# Altium project Robofest.PrjPcb
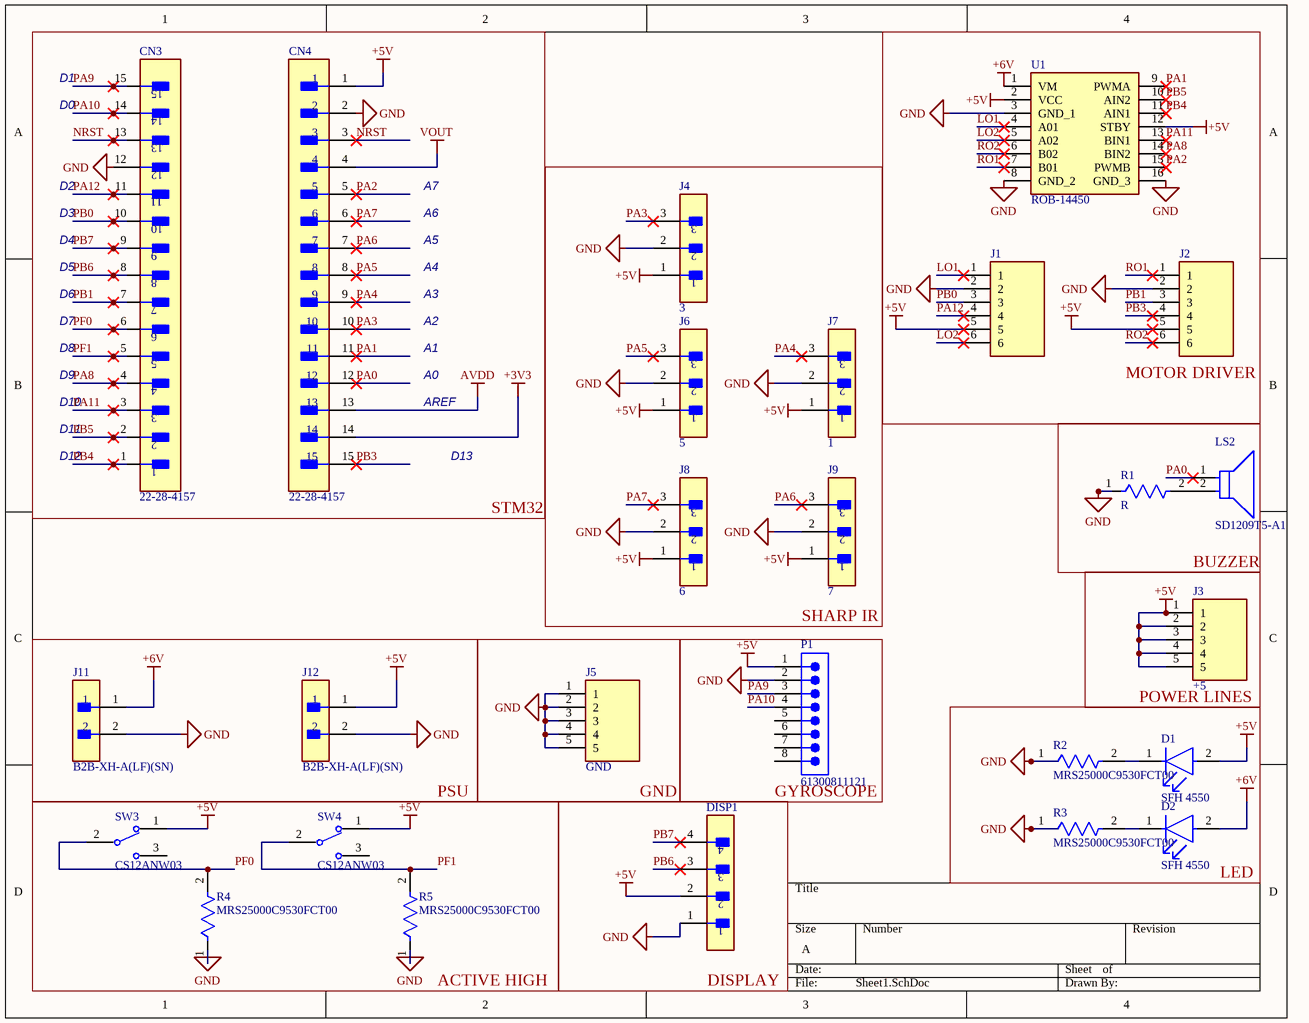
[diagram p0: Sheet1.SchDoc]
1 sheet, 26 parts. Net scope: global (net labels, ports and power ports of the same name join across sheets).
Board file: Sheet1.PcbDoc

## Sheet Sheet1.SchDoc
size A; SheetNumber: 1; SheetTotal: 1

### Parts
CN3  22-28-4157  [FP-22-28-4157-MFG]
CN4  22-28-4157  [FP-22-28-4157-MFG]
D1  SFH 4550  [FP-SFH_4550-MFG]
D2  SFH 4550  [FP-SFH_4550-MFG]
DISP1  B4B-XH-A(LF)(SN)  [FP-B4B-XH-A_LF_SN-MFG]  (value not drawn)
J1  B6B-XH-A_LF__SN_  [SHDR6W64P0X250_1X6_1740X575X700P]  (value not drawn)
J2  B6B-XH-A_LF__SN_  [SHDR6W64P0X250_1X6_1740X575X700P]  (value not drawn)
J3  +5  [SHDR5W64P0X250_1X5_1490X575X700P]
J4  3  [FP-B3B-XH-A_LF_SN-MFG]
J5  GND  [SHDR5W64P0X250_1X5_1490X575X700P]
J6  5  [FP-B3B-XH-A_LF_SN-MFG]
J7  1  [FP-B3B-XH-A_LF_SN-MFG]
J8  6  [FP-B3B-XH-A_LF_SN-MFG]
J9  7  [FP-B3B-XH-A_LF_SN-MFG]
J11  B2B-XH-A(LF)(SN)  [FP-B2B-XH-A_LF_SN-MFG]
J12  B2B-XH-A(LF)(SN)  [FP-B2B-XH-A_LF_SN-MFG]
LS2  SD1209T5-A1  [FP-SD1209-MFG]
P1  61300811121  [61300811121]
R1  R  [FP-MRS25-MFG]
R2  MRS25000C9530FCT00  [FP-MRS25-MFG]
R3  MRS25000C9530FCT00  [FP-MRS25-MFG]
R4  MRS25000C9530FCT00  [FP-MRS25-MFG]
R5  MRS25000C9530FCT00  [FP-MRS25-MFG]
SW3  CS12ANW03  [FP-CS12ANW03-MFG]
SW4  CS12ANW03  [FP-CS12ANW03-MFG]
U1  ROB-14450  [ROB14450]

### Blocks framed on the sheet
STM32: CN3 CN4
MOTOR DRIVER: J1 J2 U1
SHARP IR: J4 J6-J9
BUZZER: LS2 R1
PSU: J11 J12
GND: J5
ACTIVE HIGH: R4 R5 SW3 SW4

### Nets
+3V3: CN4.14
+5V: CN4.1 D1.2(A) DISP1.2 J1.5 J2.5 J3.1 J3.2 J3.3 J3.4 J3.5 J4.1 J6.1 J7.1 J8.1 J9.1 J12.1 P1.1 SW3.1 SW4.1 U1.2(VCC) U1.12(STBY)
+6V: D2.2(A) J11.1 U1.1(VM)
AVDD: CN4.13
GND: CN3.12 CN4.2 DISP1.1 J1.2 J2.2 J4.2 J5.1 J5.2 J5.3 J5.4 J5.5 J6.2 J7.2 J8.2 J9.2 J11.2 J12.2 P1.2 R1.1 R2.1 R3.1 R4.1 R5.1 U1.3(GND_1) U1.8(GND_2) U1.16(GND_3)
VOUT: CN4.4
LO1: J1.1 U1.4(A01)
LO2: J1.6 U1.5(A02)
NRST: CN3.13 CN4.3
PA0: CN4.12 LS2.1(C)
PA1: CN4.11 U1.9(PWMA)
PA2: CN4.5 U1.15(PWMB)
PA3: CN4.10 J4.3
PA4: CN4.9 J7.3
PA5: CN4.8 J6.3
PA6: CN4.7 J9.3
PA7: CN4.6 J8.3
PA8: CN3.4 U1.14(BIN2)
PA9: CN3.15 P1.3
PA10: CN3.14 P1.4
PA11: CN3.3 U1.13(BIN1)
PA12: CN3.11 J1.4
PB0: CN3.10 J1.3
PB1: CN3.7 J2.3
PB3: CN4.15 J2.4
PB4: CN3.1 U1.11(AIN1)
PB5: CN3.2 U1.10(AIN2)
PB6: CN3.8 DISP1.3
PB7: CN3.9 DISP1.4
PF0: CN3.6 R4.2 SW3.2(2(COM))
PF1: CN3.5 R5.2 SW4.2(2(COM))
RO1: J2.1 U1.7(B01)
RO2: J2.6 U1.6(B02)
NetD1_1: D1.1(C) R2.2
NetD2_1: D2.1(C) R3.2
NetLS2_2: LS2.2(A) R1.2

Not connected (* = marked no-connect by the designer): P1 5 6 7 8; SW3 3; SW4 3

### Notes on the sheet
- D1
- D0
- D2
- D3
- A6
- A7
- D4
- D5
- D6
- A3
- A4
- A5
- D7
- D8
- A1
- A2
- D9
- D10
- D11
- A0
- AREF
- D12
- D13
- (near J3) POWER LINES
- (near P1) GYROSCOPE
- (near D2) LED
- (near DISP1) DISPLAY

### Library data of the parts
CN3 CN4 = CMP-04776-000945-1: KK 100 HDR ASSY BKWY 15 CKT 30 S; Number of Circuits: 15; Max Voltage Rating (DC): 250.25kV; Connector Type: Male Pin; Current Rating: 4A; Glow Wire Compliant: Non-compliant; Contact Resistance: 20mR; Pitch: 2.54mm; Gender: Male; Voltage Rating: 250V; Contact Mating Length: 0.32inch; Packaging: Bulk; Min Operating Temperature: 0°C; Contact Material: Brass; Max Operating Temperature: 75°C; Number of Positions: 15; Housing Material: Thermoplastic; Termination: Solder; Number of Contacts: 15; Lead Free: Lead Free; Contact Plating: Gold; Color: Black; Housing Color: Black; Contact Type: Male Pin; Series: KK® 42375; Package Quantity: 1; Number of Rows: 1; Orientation: Straight; Mount: Through Hole
D1 D2 = CMP-62016-000011-1: EMITTER IR 860NM 100MA RADIAL; Manufacturer: Osram Opto; Forward Voltage: 1.5V; Reverse Voltage: 5V; Viewing Angle: 6°; Led Orientation: Straight; Colour: Infrared; Mouser Description: Infrared Emitters - High Power Infrared 850 nm HALF ANGLE +/-3DEG; RoHS: TRUE; Manufacturer Part Number: SFH 4550; Forward Current: 100mA; Octopart: https://octopart.com/sfh+4550-osram+opto-55410894; ComponentLink2Description: Datasheet; Lead Free: Yes; Temperature: -40°C to +100°C; ComponentLink2URL: https://dammedia.osram.info/media/resource/hires/osram-dam-5580407/SFH%204550_EN.pdf; Device Class L2: LEDs; Temperature Range Low: -40°C; Digikey Description: EMITTER IR 860NM 100MA RADIAL; Temperature Range High: +100°C; Device Class L3: unset; Peak Emmision Wavelength: 860nm; Category: Diode; Package: SFH 4550; Device Class L1: Optoelectronics; Automotive: No
DISP1 = CMP-17439-000250-1: CONN HEADER VERT 4POS 2.5MM; Number of Contacts: 4; Contact Resistance: 20mR; Voltage Rating: 250V; Max Current Rating: 3A; Gender: Male; Wire/Cable Gauge: 22AWG; Mated Stacking Heights: 9.8mm; Insulation Resistance: 1GR; Orientation: Straight; Contact Type: Male Pin; Contact Finish - Mating: TIN; Series: XH; Max Voltage Rating (AC): 250V; Lead Pitch: 2.5mm; Contact Shape: Square; Insulation Color: Natural; Termination: Solder; Lead Free: Lead Free; Voltage Rating (AC): 250V; Number of Rows: 1; Flammability Rating: UL94 V-0; Number of Positions: 4; Max Operating Temperature: 85°C; Package Quantity: 500; Mount: Through Hole; REACH SVHC: No SVHC; Connector Type: Header; Insulation Material: Nylon; Fastening Type: Detent; Min Operating Temperature: -25°C; Housing Color: White; Packaging: Bulk; Contact Plating: Tin; Contact Material: Brass; Max Voltage Rating (DC): 250V; Housing Material: Polyamide; Color: Natural; Material: Polyamide; Pitch: 2.5mm; Depth: 5.75mm; Current Rating: 3A; Length: 12.4mm
J1 J2 = B6B-XH-A_LF__SN_: Connector; Manufacturer_Name: JST (JAPAN SOLDERLESS TERMINALS); Manufacturer_Part_Number: B6B-XH-A(LF)(SN); Datasheet Link: https://datasheet.lcsc.com/szlcsc/JST-Sales-America-B6B-XH-A-LF-SN_C144397.pdf; Height: 7mm; Arrow Part Number: B6B-XH-A(LF)(SN); Arrow Price/Stock: https://www.arrow.com/en/products/b6b-xh-a-lf-sn/jst-manufacturing?utm_currency=USD&region=europe
J3 J5 = B5B-XH-A_LF__SN_: Connector; Manufacturer_Name: JST (JAPAN SOLDERLESS TERMINALS); Manufacturer_Part_Number: B5B-XH-A(LF)(SN); Datasheet Link: http://www.jst-mfg.com/product/pdf/eng/eXH.pdf; Height: 7mm; Arrow Part Number: B5B-XH-A(LF)(SN); Arrow Price/Stock: https://www.arrow.com/en/products/b5b-xh-a-lf-sn/jst-manufacturing
J4 = CMP-17439-000014-3: CONN HEADER VERT 3POS 2.5MM; Max Voltage Rating (DC): 250V; Current Rating: 3A; Gender: Male; Wire/Cable Gauge: 22AWG; Contact Resistance: 20mR; Insulation Resistance: 1GR; Insulation Material: Nylon; Number of Positions: 3; Contact Plating: Tin; Depth: 5.75mm; Contact Type: Male Pin; Max Operating Temperature: 85°C; Insulation Color: Natural; Voltage Rating (AC): 250V; Color: Natural; Connector Type: Header; Orientation: Straight; Fastening Type: Detent; Housing Color: White; Min Operating Temperature: -25°C; Termination: Solder; Voltage Rating: 250V; Series: XH; Pitch: 2.5mm; Contact Shape: Square; Number of Rows: 1; Lead Free: Lead Free; Packaging: Bulk; Mount: Through Hole; Flammability Rating: UL94 V-0; Max Voltage Rating (AC): 250V; REACH SVHC: No SVHC; Housing Material: Polyamide; Contact Material: Brass; Lead Pitch: 2.5mm; Contact Finish - Mating: TIN; Length: 9.9mm; Max Current Rating: 3A; Number of Contacts: 3
J6-J9 = CMP-17439-000014-3: CONN HEADER VERT 3POS 2.5MM; Max Voltage Rating (DC): 250V; Number of Positions: 3; Current Rating: 3A; Gender: Male; Wire/Cable Gauge: 22AWG; Contact Resistance: 20mR; Insulation Resistance: 1GR; Insulation Material: Nylon; Contact Plating: Tin; Depth: 5.75mm; Contact Type: Male Pin; Max Operating Temperature: 85°C; Insulation Color: Natural; Voltage Rating (AC): 250V; Color: Natural; Connector Type: Header; Orientation: Straight; Fastening Type: Detent; Housing Color: White; Min Operating Temperature: -25°C; Termination: Solder; Voltage Rating: 250V; Series: XH; Pitch: 2.5mm; Contact Shape: Square; Number of Rows: 1; Lead Free: Lead Free; Packaging: Bulk; Mount: Through Hole; Flammability Rating: UL94 V-0; Max Voltage Rating (AC): 250V; REACH SVHC: No SVHC; Housing Material: Polyamide; Contact Material: Brass; Lead Pitch: 2.5mm; Contact Finish - Mating: TIN; Length: 9.9mm; Max Current Rating: 3A; Number of Contacts: 3
J11 J12 = CMP-2000-05888-3: CONN HEADER VERT 2POS 2.5MM; Current Rating: 3A; Voltage Rating: 250V; Number of Contacts: 2; Contact Resistance: 20mR; Wire/Cable Gauge: 22AWG; Insulation Resistance: 1GR; Connector Type: Male Pin; Packaging: Bulk; Contact Material: Brass; Lead Free: Lead Free; Orientation: Straight; Contact Plating: Tin; Max Current Rating: 3A; Termination: Solder; Fastening Type: Detent; Depth: 5.75mm; Housing Material: Polyamide; REACH SVHC: No SVHC; Series: XH; Voltage Rating (AC): 250V; Number of Positions: 2; Color: Natural; Contact Type: Male Pin; Max Voltage Rating (DC): 250V; Pitch: 2.5mm; Lead Pitch: 2.5mm; Mount: Through Hole; Max Operating Temperature: 85°C; Length: 7.4mm; Max Voltage Rating (AC): 250V; Min Operating Temperature: -25°C; Number of Rows: 1; Housing Color: White
LS2 = CMP-08413-000009-1: AUDIO MAGNETIC XDCR 3-6V TH; Max Supply Current: 60mA; Number of Terminals/Pins: 2; Frequency: 2.048kHz; Washable: No; Operating Supply Voltage: 5V; Self Resonant Frequency: 2.05kHz; Min Operating Temperature: -40°C; Operating Supply Current: 60mA; Diameter: 12mm; Package Quantity: 100; Max Operating Temperature: 85°C; Sensing Method: Magnetic; Series: SD; Current Rating: 60mA; Lead Free: Lead Free; Height: 9mm; Packaging: Tray; Termination: PC Pins; Number of Pins: 2; Voltage Rating (DC): 5V; Mount: Through Hole
P1 = CMP-1502-01076-3: NexarPartId: 32855533; Connector Type: Male Pin; Number of Contacts: 8; Voltage Rating: 250V; Current Rating: 3A; Contact Resistance: 20mΩ; Pitch: 2.54mm; Gender: Male; Termination: Solder; Contact Material: Copper; Mount: Through Hole; Lead Pitch: 2.54mm; Number of Positions: 8; Operating Supply Voltage: 250V; Number of Pins: 8; Max Operating Temperature: 105°C; Height: 8.54mm; REACH SVHC: Unknown; Number of Rows: 1; Packaging: Bulk; Contact Plating: Gold; Contact Mating Length: 5.9944mm; Orientation: Vertical; RoHS: Compliant; Color: Black; Min Operating Temperature: -40°C
R1-R5 = CMP-02408-000049-1: RES 953 OHM 0.6W 1% AXIAL; Power Rating: 600mW; Voltage Rating: 350V; Resistance: 953R; Temperature Coefficient: 50ppm/°C; Lead Length: 26mm; Case/Package: Axial; Max Power Dissipation: 600mW; Series: MRS25; Resistance Tolerance: 1%; Packaging: Tape and Reel; Radiation Hardening: No; Min Operating Temperature: -55°C; Contact Plating: Tin; Max Operating Temperature: 155°C; Length: 6.5mm; Number of Terminations: 2; Width: 2.5mm; Construction: Cylindrical; Termination: Axial; RoHS Compliant: Yes; Lead Free: Lead Free; Military Standard: Not; Technology: THIN FILM; Diameter: 2.5mm; Tolerance: 1%; Resistor Type: Metal Film
SW3 SW4 = CMP-31746-000002-1: SWITCH SLIDE SPDT 3A 125V; Max Voltage Rating (AC): 250V; Mechanical Life: 50000Cycles; Switch Travel: 2.2mm; Electrical Life: 20000Cycles; Actuator Length: 5.1mm; Illumination Type: Non-Illuminated; Contact Style: Non-Shorting; Actuator Type: Standard; Actuator Material: Nylon; Switch Function: On-On; Max Operating Temperature: 85°C; Series: CS; Contact Current Rating: 3A; Min Operating Temperature: -30°C; Current Rating: 3A; Mount: Through Hole; Depth: 7.5mm; RoHS Compliant: Yes; Throw Configuration: SPDT; Lead Free: Lead Free; Orientation: Vertical; Contact Plating: Silver; Reach SVHC Compliant: Yes; Termination: PC Pin; Max Current Rating: 3A; Packaging: Tray; Length: 14mm; Package Quantity: 1; Primary Type: SWITCH; Flammability Rating: UL94 V-0; Contact Material: Copper; Voltage Rating (AC): 125V
U1 = ROB-14450: Undefined or Miscellaneous; Manufacturer_Name: SparkFun; Datasheet Link: https://www.sparkfun.com/products/14450; Height: 5mm; Manufacturer_Part_Number: ROB-14450; Mouser Part Number: 474-ROB-14450; Mouser Price/Stock: https://www.mouser.co.uk/ProductDetail/SparkFun/ROB-14450?qs=wd5RIQLrsJhQdlH%2FW5H2aQ%3D%3D; Arrow Part Number: ROB-14450; Arrow Price/Stock: https://www.arrow.com/en/products/rob-14450/sparkfun-electronics?region=nac